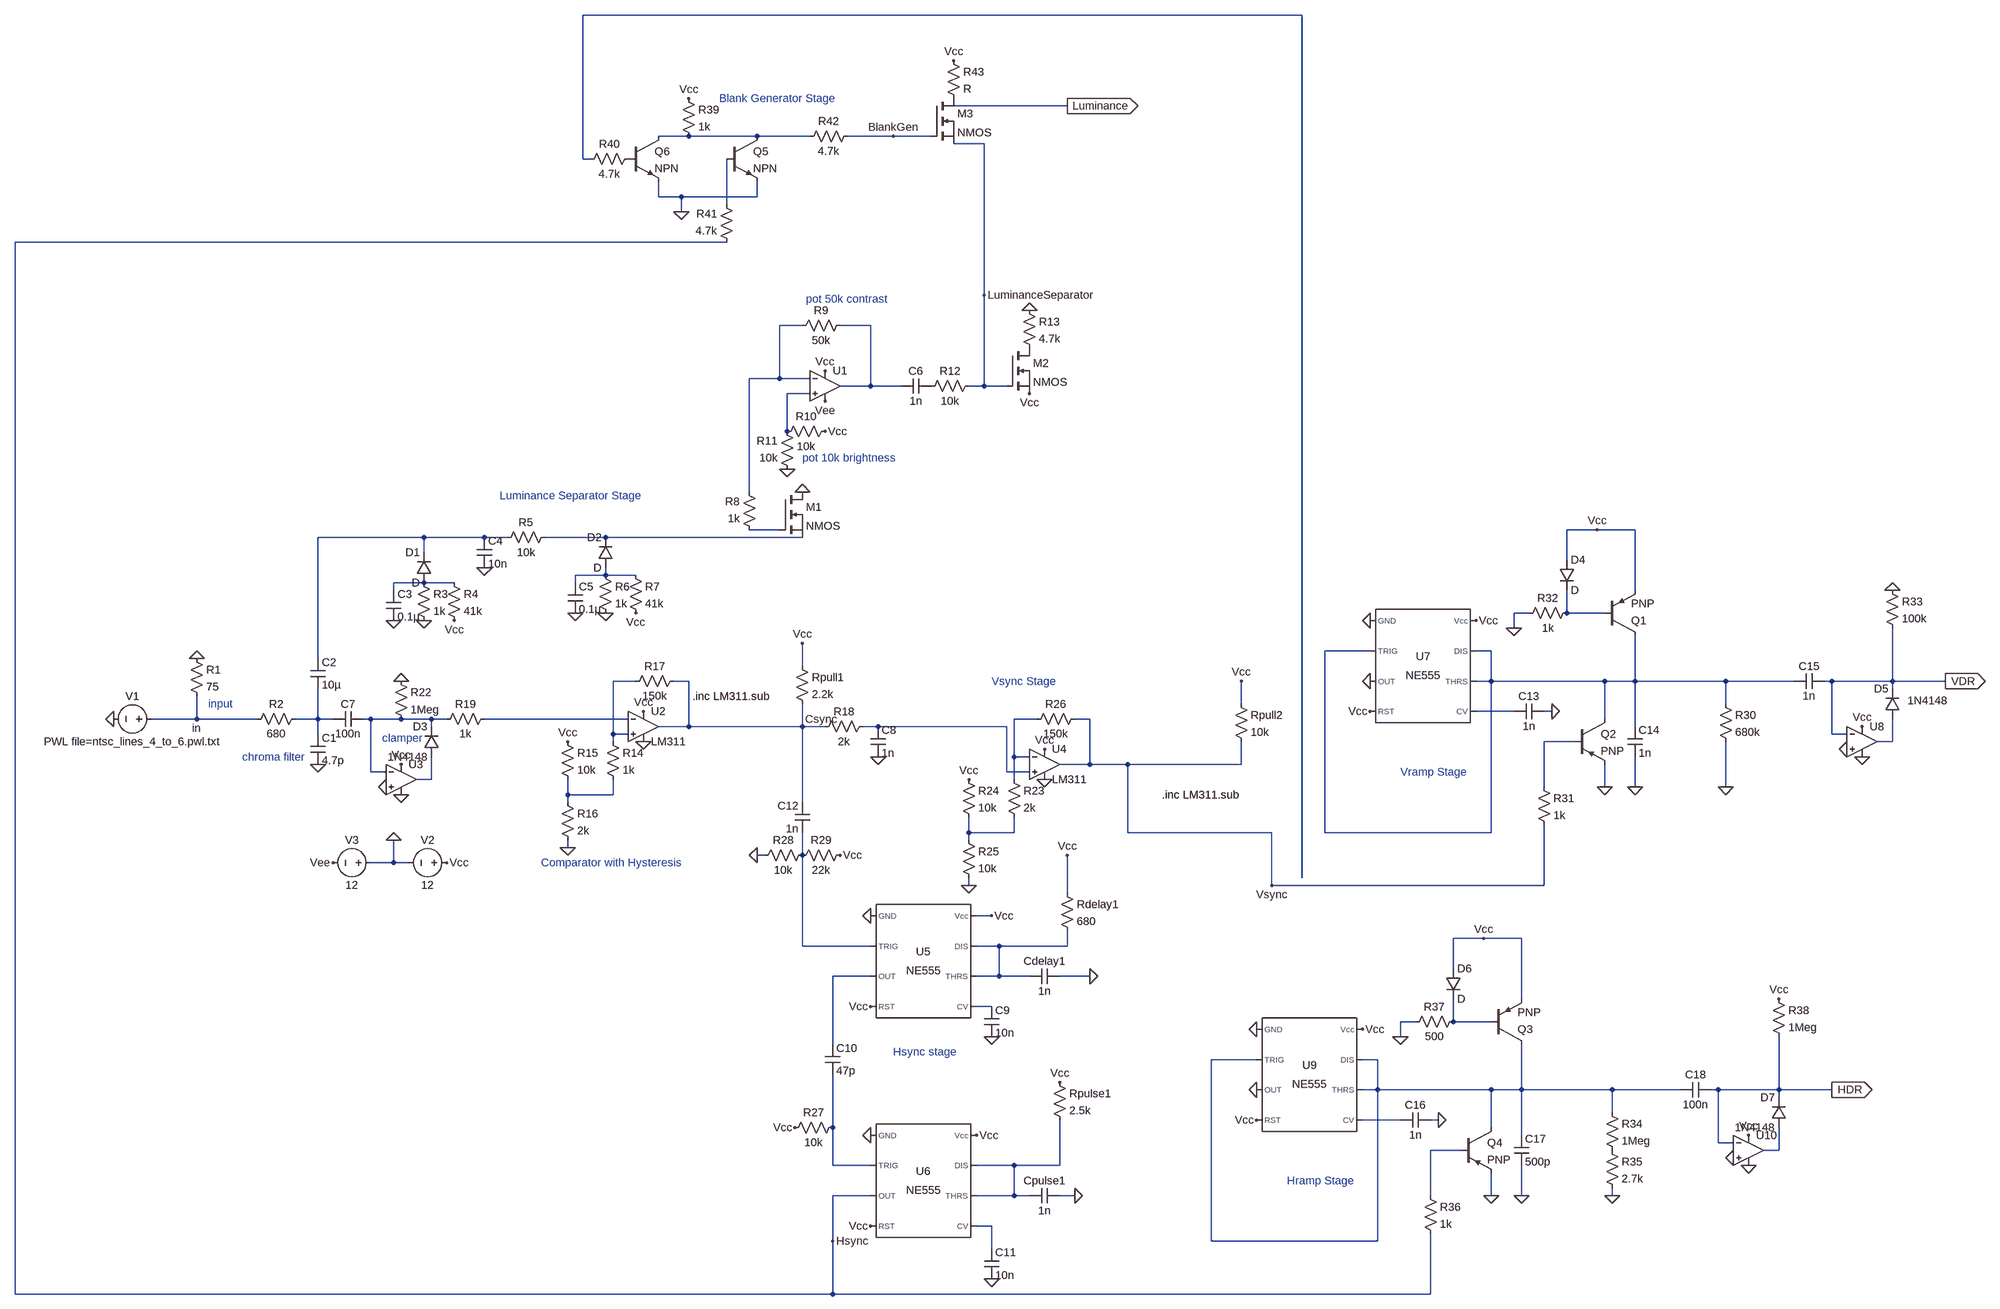
[diagram p0: schematic PerformativeCircuit.asc]
PerformativeCircuit.asc, the LTspice schematic file:
Version 4
SHEET 1 4056 2052
WIRE 2288 -1424 768 -1424
WIRE 1792 -1232 1552 -1232
WIRE 992 -1168 928 -1168
WIRE 1136 -1168 992 -1168
WIRE 1248 -1168 1136 -1168
WIRE 1424 -1168 1328 -1168
WIRE 1504 -1168 1424 -1168
WIRE 1616 -1152 1552 -1152
WIRE 768 -1120 768 -1424
WIRE 784 -1120 768 -1120
WIRE 928 -1040 928 -1072
WIRE 976 -1040 928 -1040
WIRE 1136 -1040 1136 -1072
WIRE 1136 -1040 976 -1040
WIRE 1072 -1024 1072 -1120
WIRE 976 -1008 976 -1040
WIRE 1072 -944 -432 -944
WIRE 1616 -832 1616 -1152
WIRE 1232 -768 1184 -768
WIRE 1376 -768 1312 -768
WIRE 1184 -656 1184 -768
WIRE 1184 -656 1120 -656
WIRE 1248 -656 1184 -656
WIRE 1376 -640 1376 -768
WIRE 1376 -640 1312 -640
WIRE 1440 -640 1376 -640
WIRE 1616 -640 1616 -832
WIRE 1616 -640 1584 -640
WIRE 1664 -640 1616 -640
WIRE 1248 -624 1200 -624
WIRE 1200 -544 1200 -624
WIRE 1120 -416 1120 -656
WIRE 1184 -336 1120 -336
WIRE 2912 -336 2848 -336
WIRE 2992 -336 2912 -336
WIRE 432 -320 208 -320
WIRE 560 -320 432 -320
WIRE 608 -320 560 -320
WIRE 816 -320 688 -320
WIRE 1232 -320 816 -320
WIRE 432 -288 432 -320
WIRE 2848 -272 2848 -336
WIRE 816 -240 816 -256
WIRE 816 -240 752 -240
WIRE 880 -240 816 -240
WIRE 432 -224 368 -224
WIRE 496 -224 432 -224
WIRE 752 -224 752 -240
WIRE 368 -208 368 -224
WIRE 2992 -208 2992 -336
WIRE 2768 -160 2736 -160
WIRE 2848 -160 2848 -208
WIRE 2928 -160 2848 -160
WIRE 2736 -128 2736 -160
WIRE 2432 -80 2336 -80
WIRE 2688 -80 2656 -80
WIRE 208 -64 208 -320
WIRE 1232 -48 1232 -96
WIRE 880 -16 832 -16
WIRE 992 -16 960 -16
WIRE 2688 -16 2688 -80
WIRE 2688 -16 2656 -16
WIRE 2928 -16 2688 -16
WIRE 2992 -16 2992 -112
WIRE 2992 -16 2928 -16
WIRE 3184 -16 2992 -16
WIRE 3328 -16 3184 -16
WIRE 3408 -16 3392 -16
WIRE 3536 -16 3536 -128
WIRE 3536 -16 3408 -16
WIRE 3648 -16 3536 -16
WIRE 3536 0 3536 -16
WIRE 2160 32 2160 -16
WIRE 3184 32 3184 -16
WIRE 2736 48 2656 48
WIRE 2816 48 2800 48
WIRE -48 64 -48 16
WIRE -48 64 -144 64
WIRE 80 64 -48 64
WIRE 208 64 208 0
WIRE 208 64 160 64
WIRE 240 64 208 64
WIRE 320 64 304 64
WIRE 384 64 320 64
WIRE 448 64 384 64
WIRE 480 64 448 64
WIRE 864 64 560 64
WIRE 1728 64 1680 64
WIRE 1840 64 1808 64
WIRE 2928 64 2928 -16
WIRE 448 80 448 64
WIRE 992 80 992 -16
WIRE 992 80 928 80
WIRE 1232 80 1232 32
WIRE 1232 80 992 80
WIRE 1280 80 1232 80
WIRE 1392 80 1360 80
WIRE 1664 80 1392 80
WIRE 2992 80 2992 -16
WIRE 208 96 208 64
WIRE 832 96 832 -16
WIRE 864 96 832 96
WIRE 3408 96 3408 -16
WIRE 3440 96 3408 96
WIRE 832 112 832 96
WIRE 2864 112 2800 112
WIRE 3536 112 3536 64
WIRE 3536 112 3504 112
WIRE 1680 144 1680 64
WIRE 1712 144 1680 144
WIRE 1840 160 1840 64
WIRE 1840 160 1776 160
WIRE 1920 160 1840 160
WIRE 2160 160 2160 112
WIRE 2160 160 1920 160
WIRE 320 176 320 64
WIRE 352 176 320 176
WIRE 1664 176 1664 80
WIRE 1712 176 1664 176
WIRE 448 192 448 144
WIRE 448 192 416 192
WIRE 1680 192 1680 144
WIRE 2800 208 2800 112
WIRE 2928 208 2928 160
WIRE 2992 208 2992 144
WIRE 3184 208 3184 112
WIRE 736 224 736 192
WIRE 832 224 832 192
WIRE 832 224 736 224
WIRE 736 240 736 224
WIRE 1232 240 1232 80
WIRE 1584 304 1584 272
WIRE 1680 304 1680 272
WIRE 1680 304 1584 304
WIRE 1920 304 1920 160
WIRE 2224 304 1920 304
WIRE 2336 304 2336 -80
WIRE 2688 304 2688 -16
WIRE 2688 304 2336 304
WIRE 1584 320 1584 304
WIRE 736 336 736 320
WIRE 1152 352 1136 352
WIRE 1232 352 1232 304
WIRE 368 368 368 320
WIRE 368 368 320 368
WIRE 400 368 368 368
WIRE 2288 400 2288 -1424
WIRE 1584 416 1584 400
WIRE 2224 416 2224 304
WIRE 2800 416 2800 288
WIRE 2800 416 2224 416
WIRE 1792 432 1792 352
WIRE 1632 480 1600 480
WIRE 2672 528 2608 528
WIRE 2752 528 2672 528
WIRE 1232 544 1232 352
WIRE 1376 544 1232 544
WIRE 1648 544 1600 544
WIRE 1792 544 1792 512
WIRE 1792 544 1648 544
WIRE 2608 592 2608 528
WIRE 1376 608 1296 608
WIRE 1648 608 1648 544
WIRE 1648 608 1600 608
WIRE 1712 608 1648 608
WIRE 1840 608 1776 608
WIRE 2752 656 2752 528
WIRE 1632 672 1600 672
WIRE 2528 704 2496 704
WIRE 2608 704 2608 656
WIRE 2688 704 2608 704
WIRE 2496 736 2496 704
WIRE 1296 752 1296 608
WIRE 2192 784 2096 784
WIRE 2448 784 2416 784
WIRE 2448 848 2448 784
WIRE 2448 848 2416 848
WIRE 2688 848 2448 848
WIRE 2752 848 2752 752
WIRE 2752 848 2688 848
WIRE 2944 848 2752 848
WIRE 3088 848 2944 848
WIRE 3168 848 3152 848
WIRE 3296 848 3296 736
WIRE 3296 848 3168 848
WIRE 3408 848 3296 848
WIRE 3296 864 3296 848
WIRE 2944 896 2944 848
WIRE 2496 912 2416 912
WIRE 2576 912 2560 912
WIRE 1296 928 1296 816
WIRE 2688 928 2688 848
WIRE 2752 944 2752 848
WIRE 3168 960 3168 848
WIRE 3200 960 3168 960
WIRE 2624 976 2560 976
WIRE 3296 976 3296 928
WIRE 3296 976 3264 976
WIRE 1296 1008 1296 928
WIRE 1376 1008 1296 1008
WIRE 1680 1008 1600 1008
WIRE 1776 1008 1776 912
WIRE 1776 1008 1680 1008
WIRE 1376 1072 1296 1072
WIRE 1680 1072 1680 1008
WIRE 1680 1072 1600 1072
WIRE 1712 1072 1680 1072
WIRE 1808 1072 1776 1072
WIRE 2560 1072 2560 976
WIRE 2688 1072 2688 1024
WIRE 2752 1072 2752 1008
WIRE 2944 1072 2944 1056
WIRE 1632 1136 1600 1136
WIRE 1296 1168 1296 1072
WIRE 2096 1168 2096 784
WIRE 2448 1168 2448 848
WIRE 2448 1168 2096 1168
WIRE 1632 1184 1632 1136
WIRE -432 1280 -432 -944
WIRE 1296 1280 1296 1168
WIRE 1296 1280 -432 1280
WIRE 2560 1280 2560 1152
WIRE 2560 1280 1296 1280
FLAG -224 64 0
FLAG -48 -64 0
FLAG 208 160 0
FLAG -48 64 in
FLAG 480 368 Vcc
FLAG 240 368 Vee
FLAG 368 320 0
FLAG 368 -144 0
FLAG 432 -144 0
FLAG 496 -144 Vcc
FLAG 560 -256 0
FLAG 752 -160 0
FLAG 816 -160 0
FLAG 880 -160 Vcc
FLAG 1200 -464 0
FLAG 1280 -544 Vcc
FLAG 1280 -608 Vee
FLAG 1280 -672 Vcc
FLAG 1712 -624 Vcc
FLAG 1712 -800 0
FLAG 1616 -832 LuminanceSeparator
FLAG 1232 -416 0
FLAG 736 336 0
FLAG 896 48 Vcc
FLAG 736 112 Vcc
FLAG 384 160 Vcc
FLAG 352 208 0
FLAG 384 224 0
FLAG 896 112 0
FLAG 384 -16 0
FLAG 1232 -96 Vcc
FLAG 1392 144 0
FLAG 1584 416 0
FLAG 2160 -16 Vcc
FLAG 1584 192 Vcc
FLAG 1744 192 0
FLAG 2224 416 Vsync
FLAG 1232 80 Csync
FLAG 1376 480 0
FLAG 1376 672 Vcc
FLAG 1744 128 Vcc
FLAG 1632 480 Vcc
FLAG 1792 352 Vcc
FLAG 1840 608 0
FLAG 1632 736 0
FLAG 1216 928 Vcc
FLAG 1376 944 0
FLAG 1600 944 Vcc
FLAG 1776 832 Vcc
FLAG 1808 1072 0
FLAG 1376 1136 Vcc
FLAG 1296 1168 Hsync
FLAG 1632 1248 0
FLAG 1312 352 Vcc
FLAG 1136 352 0
FLAG 2432 -144 0
FLAG 2432 48 Vcc
FLAG 2656 -144 Vcc
FLAG 2816 48 0
FLAG 2992 208 0
FLAG 2912 -336 Vcc
FLAG 3184 208 0
FLAG 2928 208 0
FLAG 2736 -128 0
FLAG 3472 80 Vcc
FLAG 3440 128 0
FLAG 3472 144 0
FLAG 3536 -208 0
FLAG 2432 -16 0
FLAG 2192 720 0
FLAG 2192 912 Vcc
FLAG 2416 720 Vcc
FLAG 2576 912 0
FLAG 2752 1072 0
FLAG 2672 528 Vcc
FLAG 2944 1072 0
FLAG 2688 1072 0
FLAG 2496 736 0
FLAG 3232 944 Vcc
FLAG 3200 992 0
FLAG 3232 1008 0
FLAG 3296 656 Vcc
FLAG 2192 848 0
FLAG 3408 848 HDR
IOPIN 3408 848 Out
FLAG 3648 -16 VDR
IOPIN 3648 -16 Out
FLAG 976 -1008 0
FLAG 992 -1248 Vcc
FLAG 1552 -1328 Vcc
FLAG 1792 -1232 Luminance
IOPIN 1792 -1232 Out
FLAG 1424 -1168 BlankGen
DATAFLAG 736 224 ""
DATAFLAG 1584 304 ""
DATAFLAG 2224 304 ""
SYMBOL voltage -128 64 R90
WINDOW 0 -32 56 VBottom 2
WINDOW 3 32 56 VTop 2
WINDOW 123 0 0 Left 0
WINDOW 39 0 0 Left 0
SYMATTR InstName V1
SYMATTR Value PWL file=ntsc_lines_4_to_6.pwl.txt
SYMBOL res -64 -80 R0
SYMATTR InstName R1
SYMATTR Value 75
SYMBOL res 176 48 R90
WINDOW 0 0 56 VBottom 2
WINDOW 3 32 56 VTop 2
SYMATTR InstName R2
SYMATTR Value 680
SYMBOL cap 192 96 R0
SYMATTR InstName C1
SYMATTR Value 4.7p
SYMBOL cap 192 -64 R0
SYMATTR InstName C2
SYMATTR Value 10µ
SYMBOL voltage 496 368 R90
WINDOW 0 -32 56 VBottom 2
WINDOW 3 32 56 VTop 2
SYMATTR InstName V2
SYMATTR Value 12
SYMBOL voltage 336 368 R90
WINDOW 0 -32 56 VBottom 2
WINDOW 3 32 56 VTop 2
SYMATTR InstName V3
SYMATTR Value 12
SYMBOL diode 448 -224 R180
WINDOW 0 24 64 Left 2
WINDOW 3 24 0 Left 2
SYMATTR InstName D1
SYMBOL res 416 -240 R0
SYMATTR InstName R3
SYMATTR Value 1k
SYMBOL res 480 -240 R0
SYMATTR InstName R4
SYMATTR Value 41k
SYMBOL cap 352 -208 R0
SYMATTR InstName C3
SYMATTR Value 0.1µ
SYMBOL cap 544 -320 R0
SYMATTR InstName C4
SYMATTR Value 10n
SYMBOL res 704 -336 R90
WINDOW 0 0 56 VBottom 2
WINDOW 3 32 56 VTop 2
SYMATTR InstName R5
SYMATTR Value 10k
SYMBOL res 800 -256 R0
SYMATTR InstName R6
SYMATTR Value 1k
SYMBOL res 864 -256 R0
SYMATTR InstName R7
SYMATTR Value 41k
SYMBOL cap 736 -224 R0
SYMATTR InstName C5
SYMATTR Value 0.1µ
SYMBOL diode 832 -256 R180
WINDOW 0 24 64 Left 2
WINDOW 3 24 0 Left 2
SYMATTR InstName D2
SYMBOL nmos 1184 -416 R0
SYMATTR InstName M1
SYMBOL res 1136 -320 R180
WINDOW 0 36 76 Left 2
WINDOW 3 36 40 Left 2
SYMATTR InstName R8
SYMATTR Value 1k
SYMBOL OpAmps\\UniversalOpAmp2 1280 -640 R0
SYMATTR InstName U1
SYMBOL res 1328 -784 R90
WINDOW 0 0 56 VBottom 2
WINDOW 3 32 56 VTop 2
SYMATTR InstName R9
SYMATTR Value 50k
SYMBOL res 1296 -560 R90
WINDOW 0 0 56 VBottom 2
WINDOW 3 32 56 VTop 2
SYMATTR InstName R10
SYMATTR Value 10k
SYMBOL res 1216 -448 R180
WINDOW 0 36 76 Left 2
WINDOW 3 36 40 Left 2
SYMATTR InstName R11
SYMATTR Value 10k
SYMBOL cap 1504 -656 R90
WINDOW 0 0 32 VBottom 2
WINDOW 3 32 32 VTop 2
SYMATTR InstName C6
SYMATTR Value 1n
SYMBOL res 1600 -656 R90
WINDOW 0 0 56 VBottom 2
WINDOW 3 32 56 VTop 2
SYMATTR InstName R12
SYMATTR Value 10k
SYMBOL nmos 1664 -720 R0
SYMATTR InstName M2
SYMBOL res 1696 -816 R0
SYMATTR InstName R13
SYMATTR Value 4.7k
SYMBOL res 816 96 R0
SYMATTR InstName R14
SYMATTR Value 1k
SYMBOL res 720 96 R0
SYMATTR InstName R15
SYMATTR Value 10k
SYMBOL res 720 224 R0
SYMATTR InstName R16
SYMATTR Value 2k
SYMBOL res 976 -32 R90
WINDOW 0 0 56 VBottom 2
WINDOW 3 32 56 VTop 2
SYMATTR InstName R17
SYMATTR Value 150k
SYMBOL OpAmps\\opamp2 896 16 R0
SYMATTR InstName U2
SYMATTR Value LM311
SYMBOL res 576 48 R90
WINDOW 0 0 56 VBottom 2
WINDOW 3 32 56 VTop 2
SYMATTR InstName R19
SYMATTR Value 1k
SYMBOL diode 464 144 R180
WINDOW 0 24 64 Left 2
WINDOW 3 24 0 Left 2
SYMATTR InstName D3
SYMATTR Value 1N4148
SYMBOL cap 304 48 R90
WINDOW 0 0 32 VBottom 2
WINDOW 3 32 32 VTop 2
SYMATTR InstName C7
SYMATTR Value 100n
SYMBOL OpAmps\\UniversalOpAmp2 384 192 R0
SYMATTR InstName U3
SYMBOL res 368 -32 R0
SYMATTR InstName R22
SYMATTR Value 1Meg
SYMBOL res 1216 -64 R0
SYMATTR InstName Rpull1
SYMATTR Value 2.2k
SYMBOL res 1376 64 R90
WINDOW 0 0 56 VBottom 2
WINDOW 3 32 56 VTop 2
SYMATTR InstName R18
SYMATTR Value 2k
SYMBOL cap 1376 80 R0
SYMATTR InstName C8
SYMATTR Value 1n
SYMBOL res 1664 176 R0
SYMATTR InstName R23
SYMATTR Value 2k
SYMBOL res 1568 176 R0
SYMATTR InstName R24
SYMATTR Value 10k
SYMBOL res 1568 304 R0
SYMATTR InstName R25
SYMATTR Value 10k
SYMBOL res 1824 48 R90
WINDOW 0 0 56 VBottom 2
WINDOW 3 32 56 VTop 2
SYMATTR InstName R26
SYMATTR Value 150k
SYMBOL res 2144 16 R0
SYMATTR InstName Rpull2
SYMATTR Value 10k
SYMBOL OpAmps\\opamp2 1744 96 R0
SYMATTR InstName U4
SYMATTR Value LM311
SYMBOL Misc\\NE555 1488 576 R0
SYMATTR InstName U5
SYMBOL res 1776 416 R0
SYMATTR InstName Rdelay1
SYMATTR Value 680
SYMBOL cap 1776 592 R90
WINDOW 0 0 32 VBottom 2
WINDOW 3 32 32 VTop 2
SYMATTR InstName Cdelay1
SYMATTR Value 1n
SYMBOL cap 1616 672 R0
SYMATTR InstName C9
SYMATTR Value 10n
SYMBOL cap 1280 752 R0
SYMATTR InstName C10
SYMATTR Value 47p
SYMBOL res 1312 912 R90
WINDOW 0 0 56 VBottom 2
WINDOW 3 32 56 VTop 2
SYMATTR InstName R27
SYMATTR Value 10k
SYMBOL Misc\\NE555 1488 1040 R0
SYMATTR InstName U6
SYMBOL res 1760 816 R0
SYMATTR InstName Rpulse1
SYMATTR Value 2.5k
SYMBOL cap 1776 1056 R90
WINDOW 0 0 32 VBottom 2
WINDOW 3 32 32 VTop 2
SYMATTR InstName Cpulse1
SYMATTR Value 1n
SYMBOL cap 1616 1184 R0
SYMATTR InstName C11
SYMATTR Value 10n
SYMBOL res 1248 336 R90
WINDOW 0 0 56 VBottom 2
WINDOW 3 32 56 VTop 2
SYMATTR InstName R28
SYMATTR Value 10k
SYMBOL cap 1248 304 R180
WINDOW 0 24 56 Left 2
WINDOW 3 24 8 Left 2
SYMATTR InstName C12
SYMATTR Value 1n
SYMBOL res 1328 336 R90
WINDOW 0 0 56 VBottom 2
WINDOW 3 32 56 VTop 2
SYMATTR InstName R29
SYMATTR Value 22k
SYMBOL Misc\\NE555 2544 -48 R0
SYMATTR InstName U7
SYMBOL cap 2800 32 R90
WINDOW 0 0 32 VBottom 2
WINDOW 3 32 32 VTop 2
SYMATTR InstName C13
SYMATTR Value 1n
SYMBOL cap 2976 80 R0
SYMATTR InstName C14
SYMATTR Value 1n
SYMBOL pnp 2928 -112 M180
SYMATTR InstName Q1
SYMBOL diode 2832 -272 R0
SYMATTR InstName D4
SYMBOL res 3168 16 R0
SYMATTR InstName R30
SYMATTR Value 680k
SYMBOL res 2784 192 R0
SYMATTR InstName R31
SYMATTR Value 1k
SYMBOL res 2864 -176 R90
WINDOW 0 0 56 VBottom 2
WINDOW 3 32 56 VTop 2
SYMATTR InstName R32
SYMATTR Value 1k
SYMBOL pnp 2864 64 R0
SYMATTR InstName Q2
SYMBOL diode 3552 64 R180
WINDOW 0 24 64 Left 2
WINDOW 3 -101 39 Left 2
SYMATTR InstName D5
SYMATTR Value 1N4148
SYMBOL cap 3392 -32 R90
WINDOW 0 0 32 VBottom 2
WINDOW 3 32 32 VTop 2
SYMATTR InstName C15
SYMATTR Value 1n
SYMBOL OpAmps\\UniversalOpAmp2 3472 112 R0
SYMATTR InstName U8
SYMBOL res 3520 -224 R0
SYMATTR InstName R33
SYMATTR Value 100k
SYMBOL Misc\\NE555 2304 816 R0
SYMATTR InstName U9
SYMBOL cap 2560 896 R90
WINDOW 0 0 32 VBottom 2
WINDOW 3 32 32 VTop 2
SYMATTR InstName C16
SYMATTR Value 1n
SYMBOL cap 2736 944 R0
SYMATTR InstName C17
SYMATTR Value 500p
SYMBOL pnp 2688 752 M180
SYMATTR InstName Q3
SYMBOL diode 2592 592 R0
SYMATTR InstName D6
SYMBOL res 2928 880 R0
SYMATTR InstName R34
SYMATTR Value 1Meg
SYMBOL res 2928 960 R0
SYMATTR InstName R35
SYMATTR Value 2.7k
SYMBOL res 2544 1056 R0
SYMATTR InstName R36
SYMATTR Value 1k
SYMBOL res 2624 688 R90
WINDOW 0 0 56 VBottom 2
WINDOW 3 32 56 VTop 2
SYMATTR InstName R37
SYMATTR Value 500
SYMBOL pnp 2624 928 R0
SYMATTR InstName Q4
SYMBOL diode 3312 928 R180
WINDOW 0 24 64 Left 2
WINDOW 3 24 0 Left 2
SYMATTR InstName D7
SYMATTR Value 1N4148
SYMBOL cap 3152 832 R90
WINDOW 0 0 32 VBottom 2
WINDOW 3 32 32 VTop 2
SYMATTR InstName C18
SYMATTR Value 100n
SYMBOL OpAmps\\UniversalOpAmp2 3232 976 R0
SYMATTR InstName U10
SYMBOL res 3280 640 R0
SYMATTR InstName R38
SYMATTR Value 1Meg
SYMBOL npn 1072 -1168 R0
SYMATTR InstName Q5
SYMBOL npn 864 -1168 R0
SYMATTR InstName Q6
SYMBOL res 976 -1264 R0
SYMATTR InstName R39
SYMATTR Value 1k
SYMBOL res 880 -1136 R90
WINDOW 0 0 56 VBottom 2
WINDOW 3 32 56 VTop 2
SYMATTR InstName R40
SYMATTR Value 4.7k
SYMBOL res 1088 -928 R180
WINDOW 0 36 76 Left 2
WINDOW 3 36 40 Left 2
SYMATTR InstName R41
SYMATTR Value 4.7k
SYMBOL res 1344 -1184 R90
WINDOW 0 0 56 VBottom 2
WINDOW 3 32 56 VTop 2
SYMATTR InstName R42
SYMATTR Value 4.7k
SYMBOL nmos 1504 -1248 R0
SYMATTR InstName M3
SYMBOL res 1536 -1344 R0
SYMATTR InstName R43
TEXT 1240 -824 Left 2 ;pot 50k contrast
TEXT 1232 -488 Left 2 ;pot 10k brightness
TEXT 1000 16 Left 2 !.inc LM311.sub
TEXT 1992 224 Left 2 !.inc LM311.sub
TEXT -24 32 Left 2 ;input
TEXT 48 144 Left 2 ;chroma filter
TEXT 344 104 Left 2 ;clamper
TEXT 680 368 Left 2 ;Comparator with Hysteresis
TEXT 1424 768 Left 2 ;Hsync stage
TEXT 1632 -16 Left 2 ;Vsync Stage
TEXT 2256 1040 Left 2 ;Hramp Stage
TEXT 2496 176 Left 2 ;Vramp Stage
TEXT 592 -408 Left 2 ;Luminance Separator Stage
TEXT 1056 -1248 Left 2 ;Blank Generator Stage

The netlist it stands for:
* PerformativeCircuit.asc
V1 in 0 PWL file=ntsc_lines_4_to_6.pwl.txt
R1 0 in 75
R2 N016 in 680
C1 N016 0 4.7p
C2 N008 N016 10µ
V2 Vcc 0 12
V3 0 Vee 12
D1 N011 N008 D
R3 N011 0 1k
R4 N011 Vcc 41k
C3 N011 0 0.1µ
C4 N008 0 10n
R5 N009 N008 10k
R6 N010 0 1k
R7 N010 Vcc 41k
C5 N010 0 0.1µ
D2 N010 N009 D
M1 0 N007 N009 N009 NMOS
R8 N007 N004 1k
XU1 N006 N004 Vcc Vee N005 level2 Avol=1Meg GBW=10Meg Slew=10Meg Ilimit=25m Rail=0 Vos=0 En=0 Enk=0 In=0 Ink=0 Rin=500Meg  ; pins In+ In- V+ V- OUT
R9 N005 N004 50k
R10 Vcc N006 10k
R11 0 N006 10k
C6 P001 N005 1n
R12 LuminanceSeparator P001 10k
M2 P002 LuminanceSeparator Vcc Vcc NMOS
R13 0 P002 4.7k
R14 N014 N024 1k
R15 Vcc N024 10k
R16 N024 0 2k
R17 Csync N014 150k
XU2 N014 N018 Vcc 0 Csync LM311  ; pins In+ In- V+ V- OUT
R19 N018 N017 1k
D3 N023 N017 1N4148
C7 N017 N016 100n
XU3 0 N017 Vcc 0 N023 level2 Avol=1Meg GBW=10Meg Slew=10Meg Ilimit=25m Rail=0 Vos=0 En=0 Enk=0 In=0 Ink=0 Rin=500Meg  ; pins In+ In- V+ V- OUT
R22 0 N017 1Meg
Rpull1 Vcc Csync 2.2k
R18 N020 Csync 2k
C8 N020 0 1n
R23 N019 N025 2k
R24 Vcc N025 10k
R25 N025 0 10k
R26 Vsync N019 150k
Rpull2 Vcc Vsync 10k
XU4 N020 N019 Vcc 0 Vsync LM311  ; pins In+ In- V+ V- OUT
XU5 0 N026 N028 Vcc N029 N027 N027 Vcc NE555  ; pins GND TRIG OUT RST CV THRS DIS Vcc
Rdelay1 Vcc N027 680
Cdelay1 0 N027 1n
C9 N029 0 10n
C10 N028 N033 47p
R27 N033 Vcc 10k
XU6 0 N033 Hsync Vcc N037 N036 N036 Vcc NE555  ; pins GND TRIG OUT RST CV THRS DIS Vcc
Rpulse1 Vcc N036 2.5k
Cpulse1 0 N036 1n
C11 N037 0 10n
R28 N026 0 10k
C12 N026 Csync 1n
R29 Vcc N026 22k
XU7 0 N013 0 Vcc N015 N013 N013 Vcc NE555  ; pins GND TRIG OUT RST CV THRS DIS Vcc
C13 0 N015 1n
C14 N013 0 1n
Q1 N013 N012 Vcc 0 PNP
D4 Vcc N012 D
R30 N013 0 680k
R31 N021 Vsync 1k
R32 N012 0 1k
Q2 N013 N021 0 0 PNP
D5 N022 VDR 1N4148
C15 VDR N013 1n
XU8 0 VDR Vcc 0 N022 level2 Avol=1Meg GBW=10Meg Slew=10Meg Ilimit=25m Rail=0 Vos=0 En=0 Enk=0 In=0 Ink=0 Rin=500Meg  ; pins In+ In- V+ V- OUT
R33 0 VDR 100k
XU9 0 N031 0 Vcc N032 N031 N031 Vcc NE555  ; pins GND TRIG OUT RST CV THRS DIS Vcc
C16 0 N032 1n
C17 N031 0 500p
Q3 N031 N030 Vcc 0 PNP
D6 Vcc N030 D
R34 N031 P003 1Meg
R35 P003 0 2.7k
R36 N034 Hsync 1k
R37 N030 0 500
Q4 N031 N034 0 0 PNP
D7 N035 HDR 1N4148
C18 HDR N031 100n
XU10 0 HDR Vcc 0 N035 level2 Avol=1Meg GBW=10Meg Slew=10Meg Ilimit=25m Rail=0 Vos=0 En=0 Enk=0 In=0 Ink=0 Rin=500Meg  ; pins In+ In- V+ V- OUT
R38 Vcc HDR 1Meg
Q5 N002 N003 0 0 NPN
Q6 N002 P004 0 0 NPN
R39 Vcc N002 1k
R40 P004 N001 4.7k
R41 Hsync N003 4.7k
R42 BlankGen N002 4.7k
M3 P005 BlankGen LuminanceSeparator LuminanceSeparator NMOS
R43 Vcc P005 R
.model D D
.lib standard.dio
.model NPN NPN
.model PNP PNP
.lib standard.bjt
.model NMOS NMOS
.model PMOS PMOS
.lib standard.mos
* pot 50k contrast
* pot 10k brightness
.inc LM311.sub
.inc LM311.sub
* input
* chroma filter
* clamper
* Comparator with Hysteresis
* Hsync stage
* Vsync Stage
* Hramp Stage
* Vramp Stage
* Luminance Separator Stage
* Blank Generator Stage
.lib UniversalOpAmp2.lib
.lib NE555.sub
.backanno
.end